# EAGLE design Data Logger (EAGLE 7.5.0)
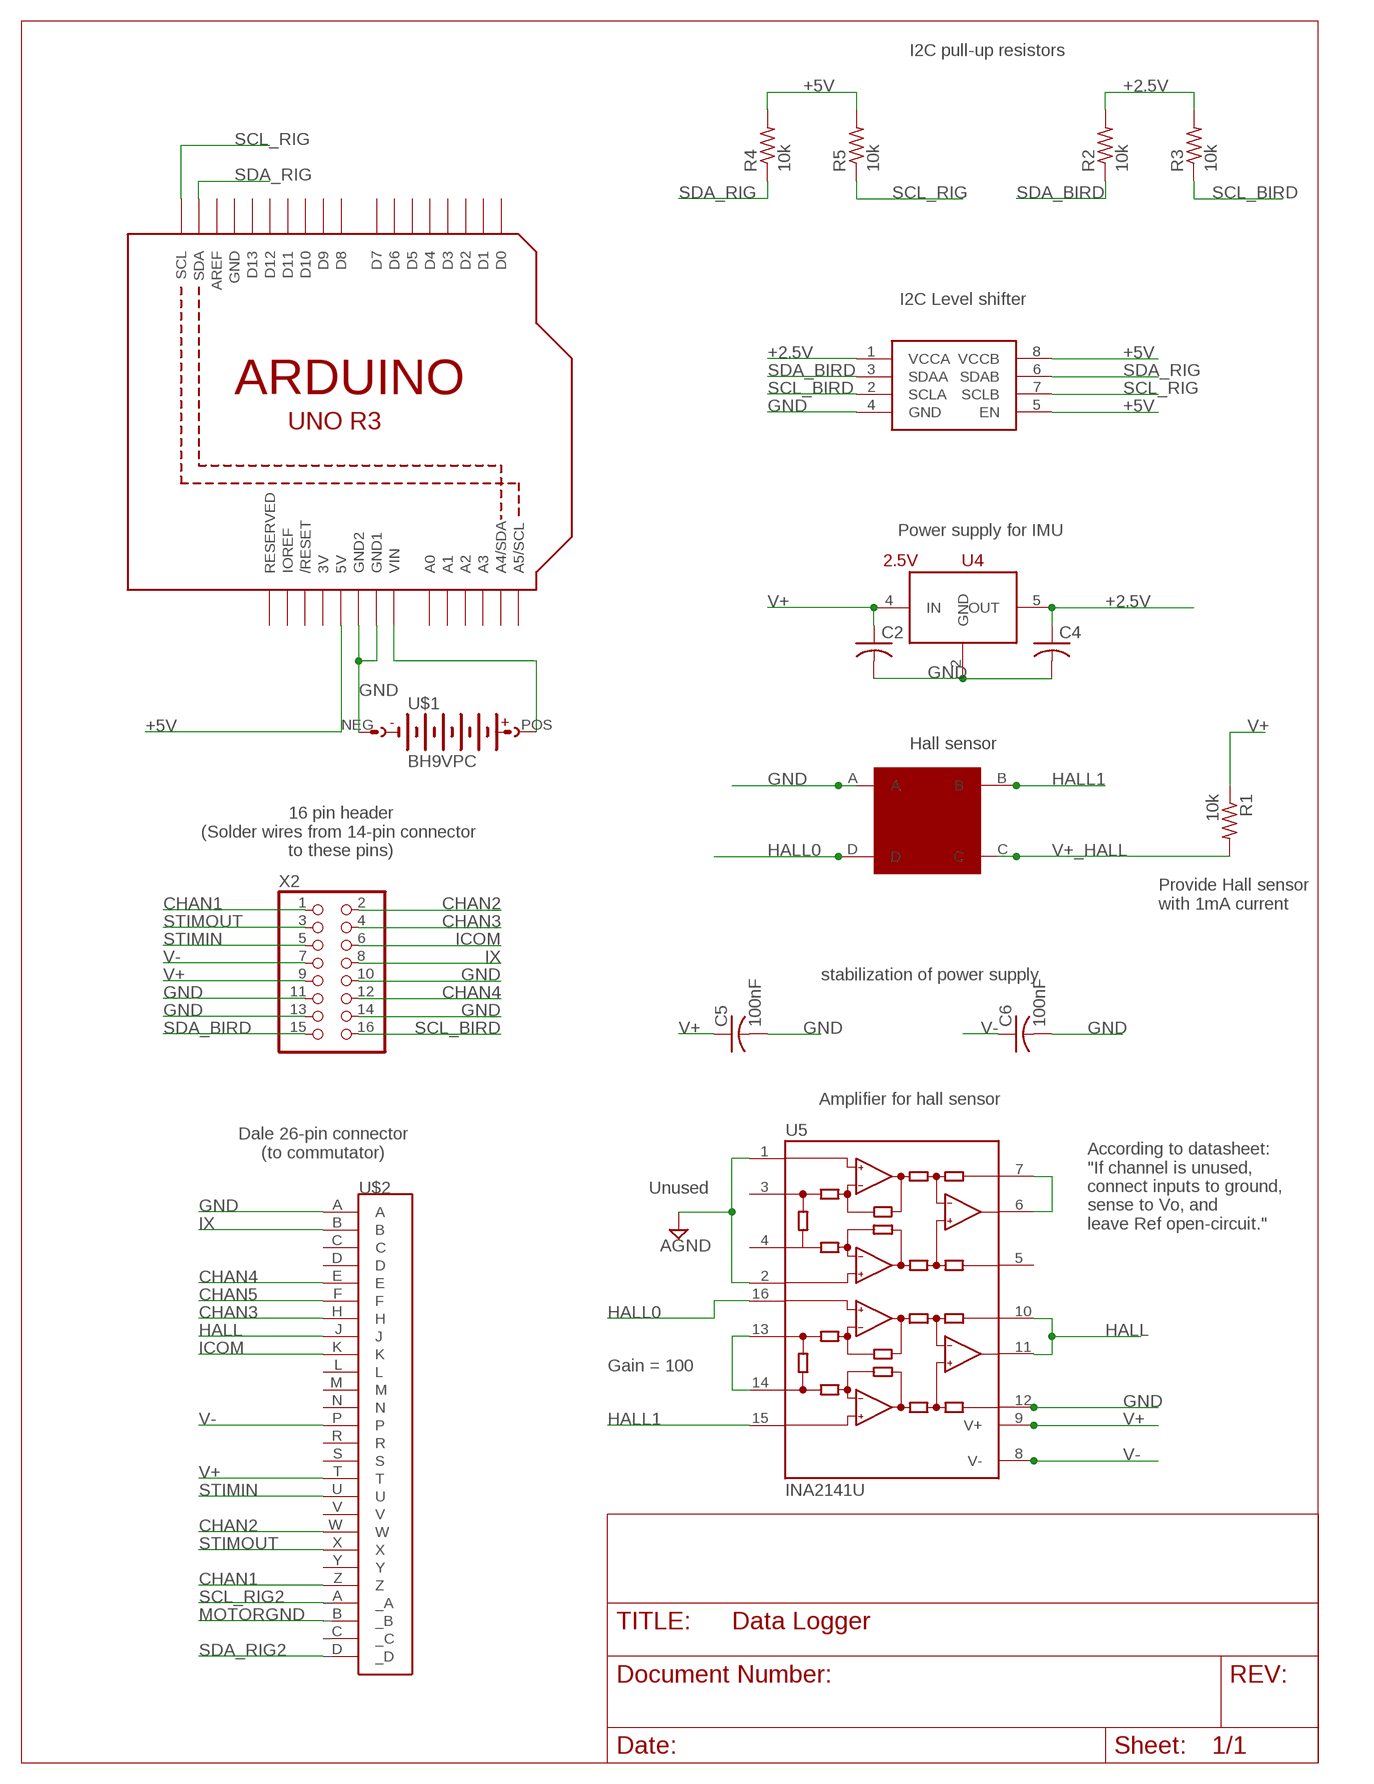
[diagram p0: schematic, sheet 1]

## Parts
C2  C-USC0402  [C0402]
C4  C-USC0402  [C0402]
C5  100nF  C-USC0805  [C0805]
C6  100nF  C-USC0805  [C0805]
R1  10k  R-US_R0805  [R0805]
R2  10k  R-US_R0402  [R0402]
R3  10k  R-US_R0402  [R0402]
R4  10k  R-US_R0402  [R0402]
R5  10k  R-US_R0402  [R0402]
U1  HALL  HALL_ON_SIDE  [HALL_ON_SIDE]
U2  PCA9517  [SO-08]
U4  2.5V  TPS715-FIXED  [SC70]
U5  INA2141U  [SO16-1]
U6  ARDUINOR3-DIMENSION  [ARDUINOR3]
U$1  BH9VPC  [BH9VPC]
U$2  MMD1P22G-26-M101  [MMD1P22G-26-M101]
X2  PINHD-2X8  [2X08]

## Nets
+2.5V: C4.1 R2.2 R3.2 U2.1(VCCA) U4.5(OUT)
+5V: R4.2 R5.2 U2.5(EN) U2.8(VCCB) U6.5V
+9V: U6.VIN U$1.POS
CHAN1: U$2.Z X2.1
CHAN2: U$2.W X2.2
CHAN3: U$2.H X2.4
CHAN4: U$2.E X2.12
CHAN5: U$2.F
GND: C2.2 C4.2 C5.2 C6.2 U1.A U2.4(GND) U4.2(GND) U5.1(INA-) U5.2(INA+) U5.12(REFB) U6.GND1 U6.GND2 U$1.NEG U$2.A X2.10 X2.11 X2.13 X2.14 ; supply symbol labelled AGND
HALL: U5.10(SENSEB) U5.11(VOB) U$2.J
HALL0: U1.D U5.16(INB-)
HALL1: U1.B U5.15(INB+)
ICOM: U$2.K X2.6
IX: U$2.B X2.8
MOTORGND: U$2._B
N$3: U5.13(JB) U5.14(JB)
SCL_BIRD: R3.1 U2.2(SCLA) X2.16
SCL_RIG: R5.1 U2.7(SCLB) U6.SCL
SCL_RIG2: U$2._A
SDA_BIRD: R2.1 U2.3(SDAA) X2.15
SDA_RIG: R4.1 U2.6(SDAB) U6.SDA
SDA_RIG2: U$2._D
STIMIN: U$2.U X2.5
STIMOUT: U$2.X X2.3
UNUSED: U5.6(VOA) U5.7(SENSEA)
V+: C2.1 C5.1 R1.1 U4.4(IN) U5.9(V+) U$2.T X2.9
V+_HALL: R1.2 U1.C
V-: C6.1 U5.8(V-) U$2.P X2.7
Unconnected: U5.3(JA) U5.4(JA) U5.5(REFA) U6.A0 U6.A1 U6.A2 U6.A3 U6.A4(A4/SDA) U6.A5(A5/SCL) U6.AREF U6.D0 U6.D1 U6.D2 U6.D3 U6.D4 U6.D5 U6.D6 U6.D7 U6.D8 U6.D9 U6.D10 U6.D11 U6.D12 U6.D13 U6.IOREF U6.RESERVED U6.RESET(/RESET) U$2._C U$2.C U$2.D U$2.L U$2.M U$2.N U$2.R U$2.S U$2.V U$2.Y

## Notes on the sheet
- I2C pull-up resistors
- I2C Level shifter
- Power supply for IMU
- Hall sensor
- 16 pin header
  (Solder wires from 14-pin connector 
  to these pins)
- Provide Hall sensor 
  with 1mA current
- stabilization of power supply
- Amplifier for hall sensor
- Dale 26-pin connector
  (to commutator)
- Unused
- According to datasheet: 
  "If channel is unused, 
  connect inputs to ground, 
  sense to Vo, and 
  leave Ref open-circuit."
- Gain = 100

## Power pins joined to a net without a drawn wire
3V: U6.3V
GND: U6.GND

## Library data of the parts
C2 C4-C6 = resistor:C-US: CAPACITOR, American symbol
R1-R5 = resistor:R-US_: RESISTOR, American symbol
U1 = elm:HALL_ON_SIDE
U2 = PCA9517:PCA9517
U4 = michael-stetner:TPS715-FIXED
U5 = burr-brown:INA2141: Instrumentation Amplifier Dual, Low Power, G = 10, 100; MF: TEXAS INSTRUMENT CONNECTORS; MPN: INA2141U; OC_FARNELL: 1459468; OC_NEWARK: 74C9853
U6 = adafruit:ARDUINOR3: This is a new object for the new Arduino R3 - with extra pins that you may want to use (such as IOref, and duplicated A4/A5
U$1 = mpd:BH9VPC
U$2 = db25-to-dale26:MMD1P22G-26-M101
X2 = pinhead:PINHD-2X8: PIN HEADER

## Net classes
0 default: width 0.254 mm

## Board
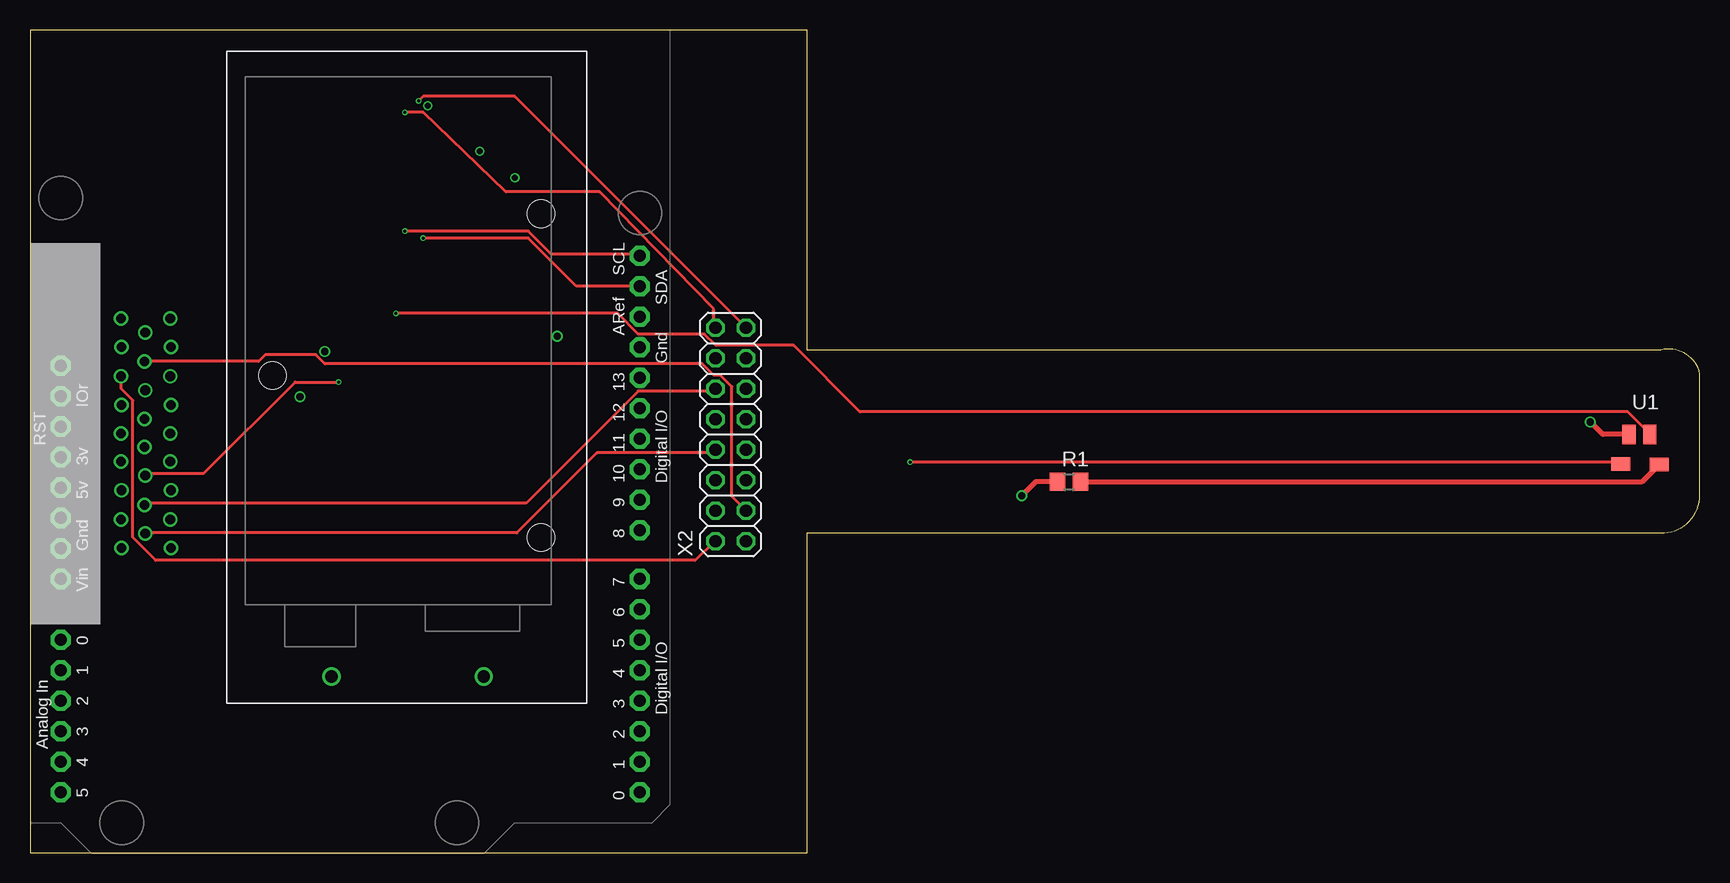
[diagram p1: board, top side]
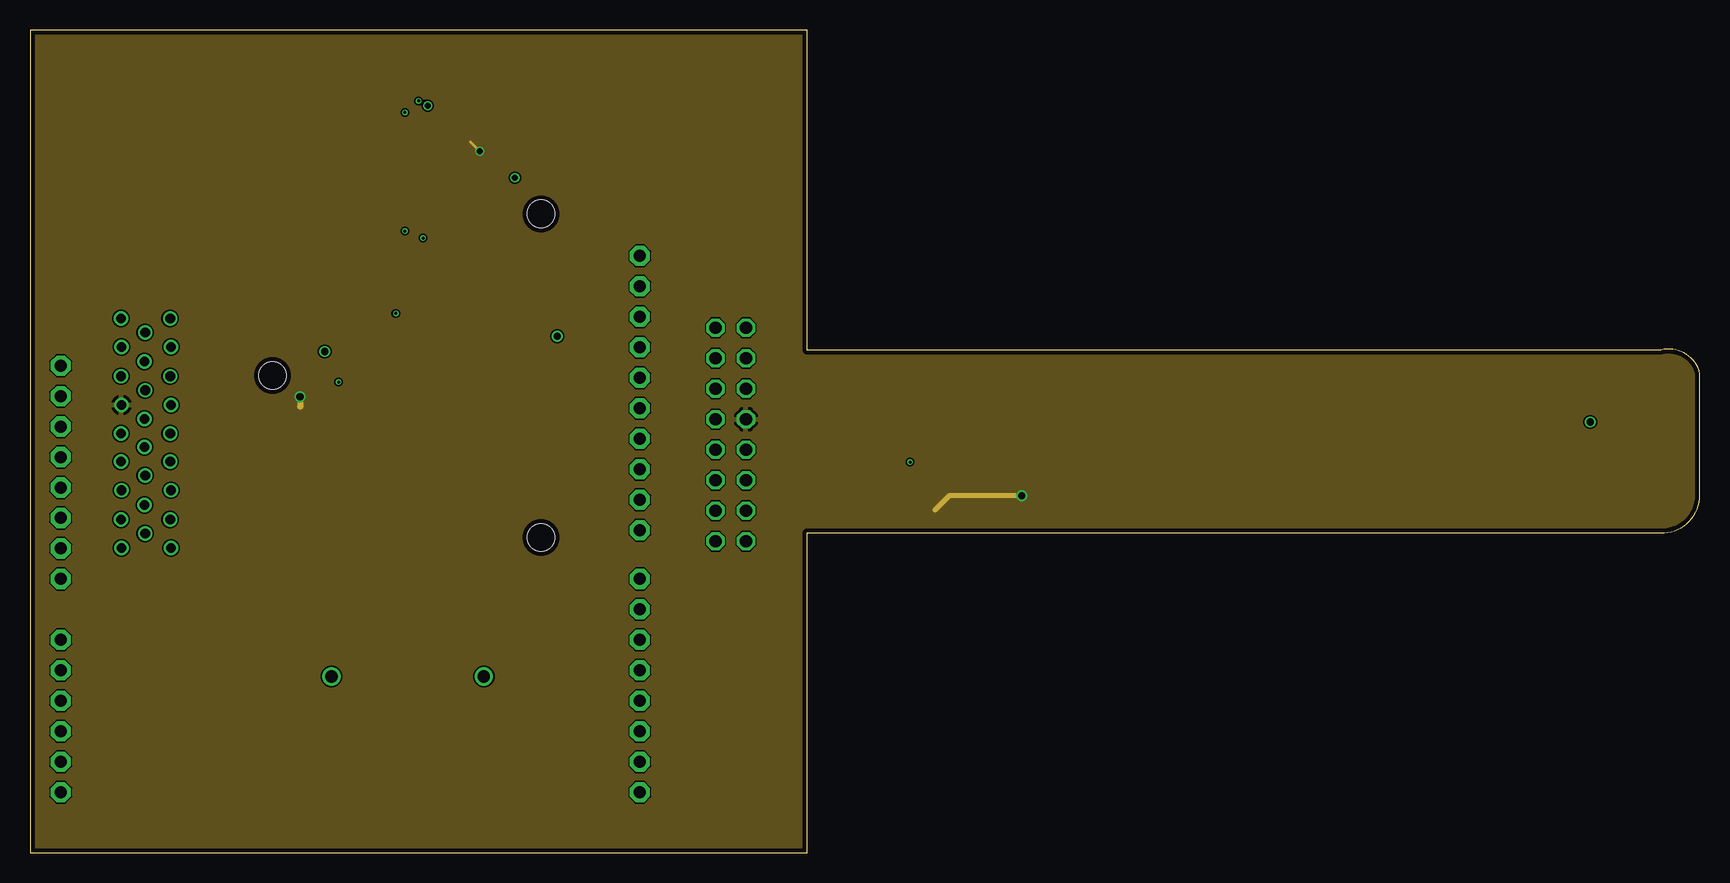
[diagram p2: board, inner layer Route2]
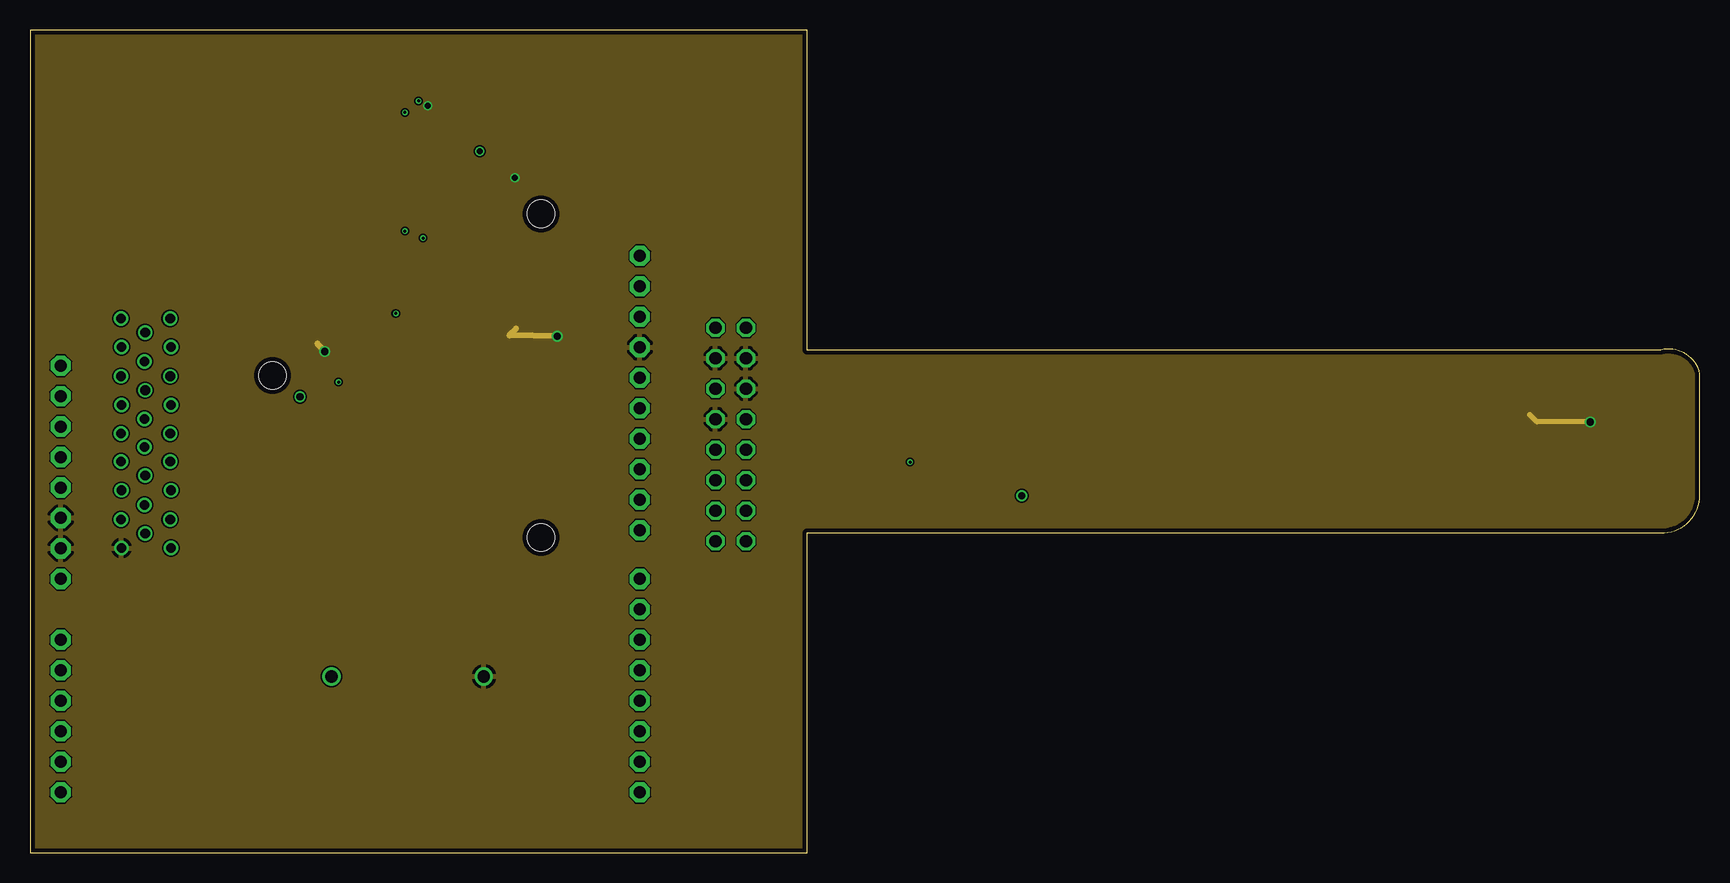
[diagram p3: board, inner layer Route15]
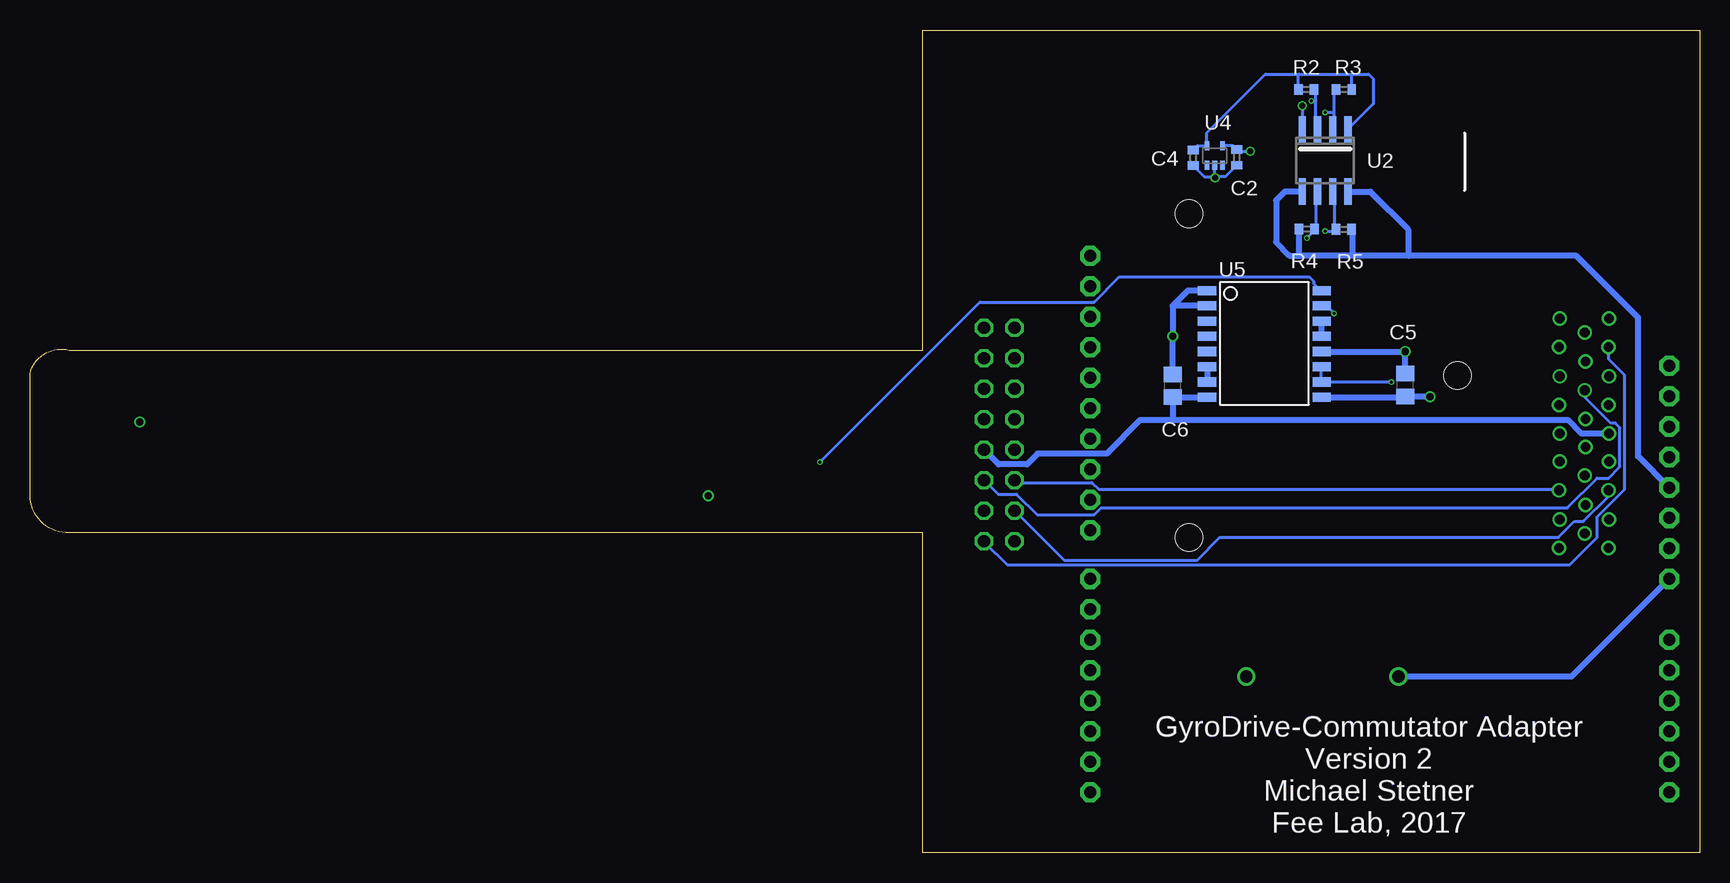
[diagram p4: board, bottom side, seen from below]

Size 139.17 x 68.58 mm. Coordinates in mm from the lower left corner, seen from the top.
Outline: 0,0 64.77,0 64.77,26.67 135.89,26.67 arc90 139.17,29.79 139.17,39.95 arc90 135.89,41.91 64.77,41.91 64.77,68.58 0,68.58 0,0
Copper layers (1*2*15*16): Top 0.035559375mm / dielectric 0.17018125mm / Route2 0.01778125mm / dielectric 47mil / Route15 0.01778125mm / dielectric 0.17018125mm / Bottom 0.035559375mm
Design rules "OSHPark-4layer *": minimum track width 5mil, minimum drill 10mil, track to track 5mil, track to pad 5mil, pad to pad 5mil, via to via 5mil, smd to smd 5mil, copper to edge 15mil, drill to drill 6mil, minimum pad ring 4mil, minimum via ring 4mil, stop-mask expansion 2.5mil, vias tented up to drill 30mil, thermal gap 10mil
tRestrict: area 0,18.8 to 6.1,50.9
bRestrict: 14 lines

### Footprints (pad centres in the part's own frame; a part is rotated, then mirrored left to right if it is on the bottom)
C0402 = smd 0.7 x 0.9: 1 -0.65,0; 2 0.65,0
C0805 = smd 1.3 x 1.5: 1 -0.95,0; 2 0.95,0
R0805 = smd 1.3 x 1.5: 1 -0.95,0; 2 0.95,0
R0402 = smd 0.7 x 0.9: 1 -0.65,0; 2 0.65,0
HALL_ON_SIDE = smd 1.118 x 1.6: A -0.838,0; B 0.889,0 | smd 1.6 x 1.118: C 1.676,-2.515; D -1.524,-2.464
SO-08 = smd 0.6 x 2.2: 1 -1.905,-2.6; 2 -0.635,-2.6; 3 0.635,-2.6; 4 1.905,-2.6; 5 1.905,2.6; 6 0.635,2.6; 7 -0.635,2.6; 8 -1.905,2.6
SC70 = smd 0.4 x 0.75: 1 -0.65,-0.825; 2 0,-0.825; 3 0.65,-0.825; 4 0.65,0.825; 5 -0.65,0.825
SO16-1 = smd 0.762 x 1.524: 1 -4.445,-4.775; 2 -3.175,-4.775; 3 -1.905,-4.775; 4 -0.635,-4.775; 5 0.635,-4.775; 6 1.905,-4.775; 7 3.175,-4.775; 8 4.445,-4.775; 9 4.445,4.775; 10 3.175,4.775; 11 1.905,4.775; 12 0.635,4.775; 13 -0.635,4.775; 14 -1.905,4.775; 15 -3.175,4.775; 16 -4.445,4.775
ARDUINOR3 = drill 1 pad 1.676 octagon: 3V 35.56,2.54; 5V 38.1,2.54; A0 50.8,2.54; A1 53.34,2.54; A2 55.88,2.54; A3 58.42,2.54; A4 60.96,2.54; A5 63.5,2.54; AREF 23.876,50.8; D0 63.5,50.8; D1 60.96,50.8; D2 58.42,50.8; D3 55.88,50.8; D4 53.34,50.8; D5 50.8,50.8; D6 48.26,50.8; D7 45.72,50.8; D8 41.656,50.8; D9 39.116,50.8; D10 36.576,50.8; D11 34.036,50.8; D12 31.496,50.8; D13 28.956,50.8; GND 26.416,50.8; GND1 43.18,2.54; GND2 40.64,2.54; IOREF 30.48,2.54; RESERVED 27.94,2.54; RESET 33.02,2.54; SCL 18.796,50.8; SDA 21.336,50.8; VIN 45.72,2.54
BH9VPC = drill 1.016: NEG 38.557,-4.75; POS 38.557,-17.45 | hole 2.286: 0,0; 26.975,0; 13.487,-22.352
MMD1P22G-26-M101 = drill 0.8: _A 9.601,8.458; _B 11.735,7.239; _C 7.569,9.627; _D 11.684,9.627; A 7.62,-9.525; B 9.601,-8.306; C 11.735,-9.525; D 7.569,-7.137; E 9.55,-5.918; F 11.684,-7.137; H 7.62,-4.699; J 9.601,-3.48; K 11.735,-4.699; L 7.569,-2.311; M 9.55,-1.092; N 11.684,-2.311; P 7.569,0.025; R 9.55,1.245; S 11.684,0.025; T 7.62,2.413; U 9.601,3.632; V 11.735,2.413; W 7.569,4.801; X 9.55,6.02; Y 11.684,4.801; Z 7.62,7.239
2X08 = drill 1.016 octagon: 1 -8.89,-1.27; 2 -8.89,1.27; 3 -6.35,-1.27; 4 -6.35,1.27; 5 -3.81,-1.27; 6 -3.81,1.27; 7 -1.27,-1.27; 8 -1.27,1.27; 9 1.27,-1.27; 10 1.27,1.27; 11 3.81,-1.27; 12 3.81,1.27; 13 6.35,-1.27; 14 6.35,1.27; 15 8.89,-1.27; 16 8.89,1.27

### Placement (x,y rotation side)
C2  38.61,57.96 270 bottom
C4  42.24,57.94 270 bottom
C5  24.56,38.99 90 bottom
C6  43.94,38.94 90 bottom
R1  86.59,30.94 0 top
R2  32.82,63.63 180 bottom
R3  29.67,63.63 0 bottom
R4  32.77,51.99 180 bottom
R5  29.69,51.97 0 bottom
U1  134.09,34.87 0 top
U2  31.24,57.71 180 bottom
U4  40.44,58.12 0 bottom
U5  36.3,42.42 270 bottom
U6  0.03,68.55 270 top
U$1  42.57,53.26 270 top
U$2  0,34.92 0 top
X2  58.39,34.87 90 top

### Tracks (layer width: path | path; a pad name or v marks a point on that pad's centre or on a via)
+2.5V
  Bottom 0.254: C4.1 41.89,58.94 U4.5 41.11,60.01 36.22,64.9 33.43,64.9 | 33.43,64.9 28.93,64.9 | 28.93,64.9 27.61,64.9 27.23,64.52 27.23,62.42 U2.1 | R3.2 29.02,64.81 28.93,64.9 | R2.2 33.47,64.86 33.43,64.9
+5V
  Bottom 0.508: U6.5V 5.16,33.05 5.16,44.6 10.31,49.76 24.26,49.76 | 24.26,49.76 28.98,49.77 | 28.98,49.77 33.22,49.78 33.43,49.78 | R4.2 33.38,51.95 33.43,51.9 33.43,49.78 | U2.8 27.47,55.11 24.33,51.97 24.33,49.84 24.26,49.76 | U2.5 34.6,55.11 35.33,54.38 35.33,50.9 34.21,49.78 33.43,49.78 | R5.2 28.98,51.91 28.98,49.77
+9V
  Bottom 0.508: U$1.POS 10.69,14.71 U6.VIN
CHAN1
  Bottom 0.254: U$2.Z 7.62,41.15 6.29,39.81 6.29,30.29 8.57,28 8.57,26.29 10.86,24 57.72,24 59.63,25.91 X2.1
CHAN2
  Top 0.254: U$2.W 7.62,39.62 7.62,38.67 8.57,37.72 8.57,26.29 10.48,24.38 55.44,24.38 56.96,25.91 X2.2
CHAN3
  Bottom 0.254: U$2.H 7.62,29.72 9.72,27.62 10.48,27.62 11.81,26.29 40.01,26.29 41.91,24.38 52.96,24.38 56.96,28.38 X2.4
CHAN4
  Top 0.254: U$2.E 9.72,29.15 41.34,29.15 50.67,38.48 56.77,38.48 56.96,38.67 X2.12
GND  (via drill 0.51, 0.6)
  Top 0.406: U1.A 131.06,34.87 v130.02,35.92
  Route15 0.406: v130.02,35.92 125.58,35.92 124.94,36.55
  Route15 0.508: v24.56,41.78 24.54,41.86 23.95,42.44 | v43.94,43.05 39.95,43.13 40.51,43.69
  Bottom 0.254: C2.2 39.56,56.36 40.44,56.36 | 40.44,56.36 U4.2 | C4.2 41.31,56.36 40.55,56.36 | 40.55,56.36 40.44,56.36 | v33.15,62.26 U2.4 | 40.55,56.36 40.55,56.38 v40.41,56.26
  Bottom 0.508: C5.2 v24.56,41.78 U5.12 | C6.2 v43.94,43.05 43.94,45.59 | U5.2 43.94,45.59 | U5.1 42.67,46.86 43.94,45.59
  pour Route15: 0,0 64.77,0 64.77,26.67 139.17,26.67 139.17,31.04 139.17,41.91 129.69,41.91 64.77,41.91 64.77,68.58 0,68.58
HALL  (via drill 0.25)
  Top 0.254: v25.72,39.24 22.1,39.24 14.48,31.62 9.72,31.62 U$2.J
  Bottom 0.254: U5.11 31.62,40.39 31.62,39.24 U5.10 v25.72,39.24
HALL0  (via drill 0.25)
  Top 0.254: v73.34,32.58 132.4,32.58 U1.D
  Bottom 0.254: v73.34,32.58 60.01,45.91 50.48,45.91 48.39,48.01 32.58,48.01 32.19,47.62 32.19,47.43 31.62,46.86 U5.16
HALL1  (via drill 0.25)
  Top 0.254: v30.48,44.96 48.96,44.96 50.67,43.24 56.2,43.24 57.15,42.29 63.63,42.29 69.15,36.77 133.16,36.77 134.87,35.05 U1.B
  Bottom 0.254: v30.48,44.96 31.05,45.53 31.43,45.53 U5.15
ICOM
  Bottom 0.254: U$2.K 11.81,30.29 50.1,30.29 50.67,30.86 56.77,30.86 56.96,31.05 X2.6
IX
  Top 0.254: U$2.B 9.72,26.67 40.58,26.67 47.24,33.34 56.77,33.34 56.96,33.53 X2.8
N$3
  Bottom 0.508: U5.13 U5.14
SCL_BIRD  (via drill 0.25)
  Top 0.254: v31.24,61.72 32.77,61.72 39.65,55.09 47.46,55.09 56.96,45.34 56.96,43.81 X2.16
  Bottom 0.254: 30.48,61.72 30.48,60.39 U2.2 | 30.48,61.72 30.48,63.63 R3.1 | v31.24,61.72 30.48,61.72
SCL_RIG  (via drill 0.25)
  Top 0.254: v31.24,51.82 41.53,51.82 43.43,49.91 50.67,49.91 U6.SCL
  Bottom 0.254: U2.7 30.48,55.05 30.48,52.01 R5.1 30.48,51.82 v31.24,51.82
SDA_BIRD  (via drill 0.25)
  Top 0.254: v32.38,62.67 32.77,63.06 40.39,63.06 59.63,43.81 X2.15
  Bottom 0.254: 32,62.67 32,60.39 U2.3 | 32,62.67 32,63.63 R2.1 | v32.38,62.67 32,62.67
SDA_RIG  (via drill 0.25)
  Top 0.254: v32.77,51.24 41.53,51.24 45.53,47.24 50.67,47.24 U6.SDA
  Bottom 0.254: U2.6 32,55.05 32,52.01 R4.1 32.19,51.82 v32.77,51.24
STIMIN
  Bottom 0.254: U$2.U 9.53,38.48 9.53,37.91 7.43,35.81 7.05,35.81 6.67,35.43 6.67,32.19 7.62,31.24 8.57,31.24 11.05,28.77 49.91,28.77 50.48,28.19 55.24,28.19 56.96,29.91 58.48,29.91 59.63,31.05 X2.5
STIMOUT
  Top 0.254: U$2.X 9.72,40.96 19.05,40.96 19.62,41.53 23.81,41.53 24.57,40.77 56.01,40.77 56.96,39.81 57.53,39.81 58.48,38.86 58.48,29.72 59.63,28.57 X2.3
UNUSED
  Bottom 0.508: U5.6 U5.7
V+  (via drill 0.51, 0.6)
  Top 0.406: R1.1 83.82,30.94 v82.65,29.77
  Route2 0.254: v37.49,58.47 36.73,59.23
  Route2 0.406: v82.65,29.77 76.61,29.77 75.41,28.57
  Route2 0.508: v22.5,38.02 22.5,37.21 22.53,37.19
  Bottom 0.254: U4.4 38.94,58.94 C2.1 38.46,58.47 v37.49,58.47
  Bottom 0.508: U5.9 24.57,37.97 C5.1 22.52,38.04 v22.5,38.02
  pour Route2: -0.03,68.58 64.77,68.53 64.77,41.91 139.12,41.91 139.12,26.67 64.77,26.67 64.77,0 0.08,0
V+_HALL
  Top 0.406: R1.2 134.34,30.94 U1.C
V-
  Bottom 0.508: U$2.P 9.88,34.95 11,36.07 44.12,36.07 | 44.12,36.07 46.69,36.07 49.43,33.27 55.19,33.27 56.08,32.38 58.45,32.38 X2.7 | 44.12,36.07 43.94,36.12 C6.1 41.09,37.99 U5.8

### Text on the board
bPlace: GyroDrive-Commutator Adapter / Version 2 / Michael Stetner / Fee Lab, 2017